# EAGLE schematic mulemachinePCB_withLEDs (EAGLE 9.6.2)
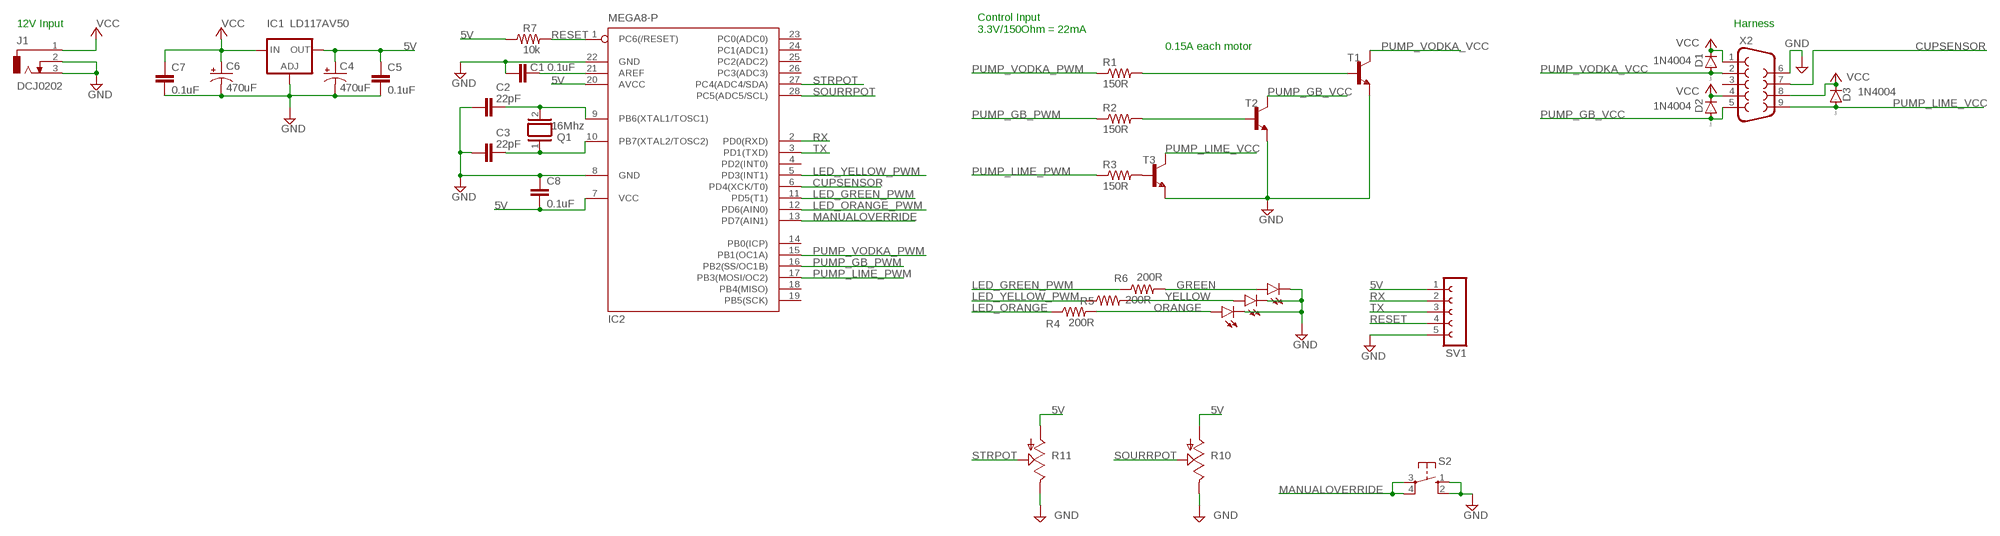
[diagram p0: schematic, sheet 1]

## Parts
C1  0.1uF  C2,5-3  [C2.5-3]
C2  22pF  C2,5-3  [C2.5-3]
C3  22pF  C2,5-3  [C2.5-3]
C4  470uF  CPOL-USE2.5-6  [E2,5-6]
C5  0.1uF  C2,5-3  [C2.5-3]
C6  470uF  CPOL-USE2.5-6  [E2,5-6]
C7  0.1uF  C2,5-3  [C2.5-3]
C8  0.1uF  C2,5-3  [C2.5-3]
D1  1N4004  [DO41-10]
D2  1N4004  [DO41-10]
D3  1N4004  [DO41-10]
IC1  LD117AV50  [TO220L1]
IC2  MEGA8-P  [DIL28-3]
J1  DCJ0202  [DCJ0202]
LED1  LED5MM  [LED5MM]
LED2  LED5MM  [LED5MM]
LED3  LED5MM  [LED5MM]
Q1  16Mhz  XTAL/S  [QS]
R1  150R  R-US_0411/12  [0411/12]
R2  150R  R-US_0411/12  [0411/12]
R3  150R  R-US_0411/12  [0411/12]
R4  200R  R-US_0411/12  [0411/12]
R5  200R  R-US_0411/12  [0411/12]
R6  200R  R-US_0411/12  [0411/12]
R7  10k  R-US_0207/10  [0207/10]
R10  US-EVUF3L  [EVUFXL]
R11  US-EVUF3L  [EVUFXL]
S2  10-XX  [B3F-10XX]
SV1  FE05-1  [FE05-1]
T1  2N4401-NPN-TO92-EBC  [TO92-EBC]
T2  2N4401-NPN-TO92-EBC  [TO92-EBC]
T3  2N4401-NPN-TO92-EBC  [TO92-EBC]
X2  F09HP  [F09HP]

## Nets
5V: C4.+ C5.1 C8.2 IC1.2(OUT) IC2.7(VCC) IC2.20(AVCC) R7.1 R10.1(A) R11.1(A) SV1.1
CUPSENSOR: IC2.6(PD4(XCK/T0)) X2.7
GND [Power]: C1.2 C2.2 C3.2 C4.- C5.2 C6.- C7.2 C8.1 IC1.1(ADJ) IC2.8(GND) IC2.22(GND) J1.2 J1.3 LED1.K(C) LED2.K(C) LED3.K(C) R10.3(E) R11.3(E) S2.1(S) S2.2(S1) SV1.5 T1.E T2.E T3.E X2.6
GREEN: LED3.A R6.2
LED_GREEN_PWM: IC2.11(PD5(T1)) R6.1
LED_ORANGE: R4.1
LED_ORANGE_PWM: IC2.12(PD6(AIN0))
LED_YELLOW_PWM: IC2.5(PD3(INT1)) R5.1
MANUALOVERRIDE: IC2.13(PD7(AIN1)) S2.3(P) S2.4(P1)
N$5: R3.2 T3.B
N$6: R2.2 T2.B
N$10: R1.2 T1.B
N$11: C3.1 IC2.10(PB7(XTAL2/TOSC2)) Q1.1
N$12: C2.1 IC2.9(PB6(XTAL1/TOSC1)) Q1.2
N$13: C1.1 IC2.21(AREF)
ORANGE: LED1.A R4.2
PUMP_GB_PWM: IC2.16(PB2(SS/OC1B)) R2.1
PUMP_GB_VCC [Power]: D2.A T2.C X2.5
PUMP_LIME_PWM: IC2.17(PB3(MOSI/OC2)) R3.1
PUMP_LIME_VCC [Power]: D3.A T3.C X2.9
PUMP_VODKA_PWM: IC2.15(PB1(OC1A)) R1.1
PUMP_VODKA_VCC [Power]: D1.A T1.C X2.2
RESET: IC2.1(PC6(/RESET)) R7.2 SV1.4
RX: IC2.2(PD0(RXD)) SV1.2
SOURRPOT: IC2.28(PC5(ADC5/SCL)) R10.2(S)
STRPOT: IC2.27(PC4(ADC4/SDA)) R11.2(S)
TX: IC2.3(PD1(TXD)) SV1.3
VCC [Power]: C6.+ C7.1 D1.C D2.C D3.C IC1.3(IN) J1.1 X2.1 X2.4 X2.8
YELLOW: LED2.A R5.2
Unconnected: IC2.4(PD2(INT0)) IC2.14(PB0(ICP)) IC2.18(PB4(MISO)) IC2.19(PB5(SCK)) IC2.23(PC0(ADC0)) IC2.24(PC1(ADC1)) IC2.25(PC2(ADC2)) IC2.26(PC3(ADC3)) X2.3

## Notes on the sheet
- 12V Input | Harness
- Control Input
  3.3V/150Ohm = 22mA
- 0.15A each motor

## Library data of the parts
C1-C3 C5 C7 C8 = capacitor-wima:C: CAPACITOR naming: grid - package width
C4 C6 = rcl:CPOL-US: POLARIZED CAPACITOR, American symbol; SPICEPREFIX: C
D1-D3 = diode:1N4004: DIODE general purpose rectifier, 1 A
IC1 = v-reg:LD117A?*: Low drop fixed and adjustable positive voltage regulators 1 A Source: http://www.st.com/stonline/products/literature/ds/7194/ld1117axx.pdf
IC2 = atmel:MEGA8-P: MICROCONTROLLER 8 Kbytes FLASH, 1 kbytes SRAM, 512 bytes EEPROM, USART, 4-channel 10 bit ADC, 2-channel 8 bit ADC Pin compatible with Atmega48, ATMega88, ATMega168 Source: avr.lbr; OC_FARNELL: unknown; OC_NEWARK: unknown
J1 = con-jack:DCJ0202: DC POWER JACK Source: DCJ0202.pdf; OC_FARNELL: unknown; OC_NEWARK: unknown
LED1-LED3 = led:LED: LED OSRAM: - CHIPLED LG R971, LG N971, LY N971, LG Q971, LY Q971, LO R971, LY R971 LH N974, LH R974 LS Q976, LO Q976, LY Q976 LO Q996 - Hyper CHIPLED LW Q18S LB Q993, LB Q99A, LB R99A - SideLED LS A670, LO A670, LY A670, LG A670, LP A670 LB A673, LV A673, LT A673, LW A673 LH A674 LY A675 LS A676, LA A676, LO A676, LY A676, LW A676 LS A679, LY A679, LG A679 - Hyper Micro SIDELED® LS Y876, LA Y876, LO Y876, LY Y876 LT Y87S - SmartLED LW L88C, LW L88S LB L89C, LB L89S, LG L890 LS L89K, LO L89K, LY L89K LS L896, LA L896, LO L896, LY L896 - TOPLED LS T670, LO T670, LY T670, LG T670, LP T670 LSG T670, LSP T670, LSY T670, LOP T670, LYG T670 LG T671, LOG T671, LSG T671 LB T673, LV T673, LT T673, LW T673 LH T674 LS T676, LA T676, LO T676, LY T676, LB T676, LH T676, LSB T676, LW T676 LB T67C, LV T67C, LT T67C, LS T67K, LO T67K, LY T67K, LW E67C LS E67B, LA E67B, LO E67B, LY E67B, LB E67C, LV E67C, LT E67C LW T67C LS T679, LY T679, LG T679 LS T770, LO T770, LY T770, LG T770, LP T770 LB T773, LV T773, LT T773, LW T773 LH T774 LS E675, LA E675, LY E675, LS T675 LS T776, LA T776, LO T776, LY T776, LB T776 LHGB T686 LT T68C, LB T68C - Hyper Mini TOPLED® LB M676 - Mini TOPLED Santana® LG M470 LS M47K, LO M47K, LY M47K Source: http://www.osram.convergy.de LUXEON: - LUMILED® LXK2-PW12-R00, LXK2-PW12-S00, LXK2-PW14-U00, LXK2-PW14-V00 LXK2-PM12-R00, LXK2-PM12-S00, LXK2-PM14-U00 LXK2-PE12-Q00, LXK2-PE12-R00, LXK2-PE12-S00, LXK2-PE14-T00, LXK2-PE14-U00 LXK2-PB12-K00, LXK2-PB12-L00, LXK2-PB12-M00, LXK2-PB14-N00, LXK2-PB14-P00, LXK2-PB14-Q00 LXK2-PR12-L00, LXK2-PR12-M00, LXK2-PR14-Q00, LXK2-PR14-R00 LXK2-PD12-Q00, LXK2-PD12-R00, LXK2-PD12-S00 LXK2-PH12-R00, LXK2-PH12-S00 LXK2-PL12-P00, LXK2-PL12-Q00, LXK2-PL12-R00 Source: www.luxeon.com KINGBRIGHT: KA-3528ASYC Source: www.kingbright.com
Q1 = special:XTAL/S: CRYSTAL
R1-R7 = rcl:R-US_: RESISTOR, American symbol; SPICEPREFIX: R
R10 R11 = pot:US-EVU: 9 mm Square Rotary Potentiometers Source: Panasonic
S2 = switch-omron:10-XX: OMRON SWITCH; MPN: B3F-1000; OC_FARNELL: 176432; OC_NEWARK: 36M3542
SV1 = con-lsta:FE05-1: FEMALE HEADER; OC_FARNELL: unknown; OC_NEWARK: unknown
T1-T3 = transistor-neu-to92:*-NPN-: NPN Transistror
X2 = con-subd:F09: SUB-D; OC_FARNELL: unknown; OC_NEWARK: unknown

## Net classes
0 default: width 0.305 mm, drill 0.508 mm, clearance 0.254 mm
1 Power: width 0.787 mm, drill 0.508 mm, clearance 0.254 mm